# EAGLE design synth r0.1 (EAGLE 9.1.3)
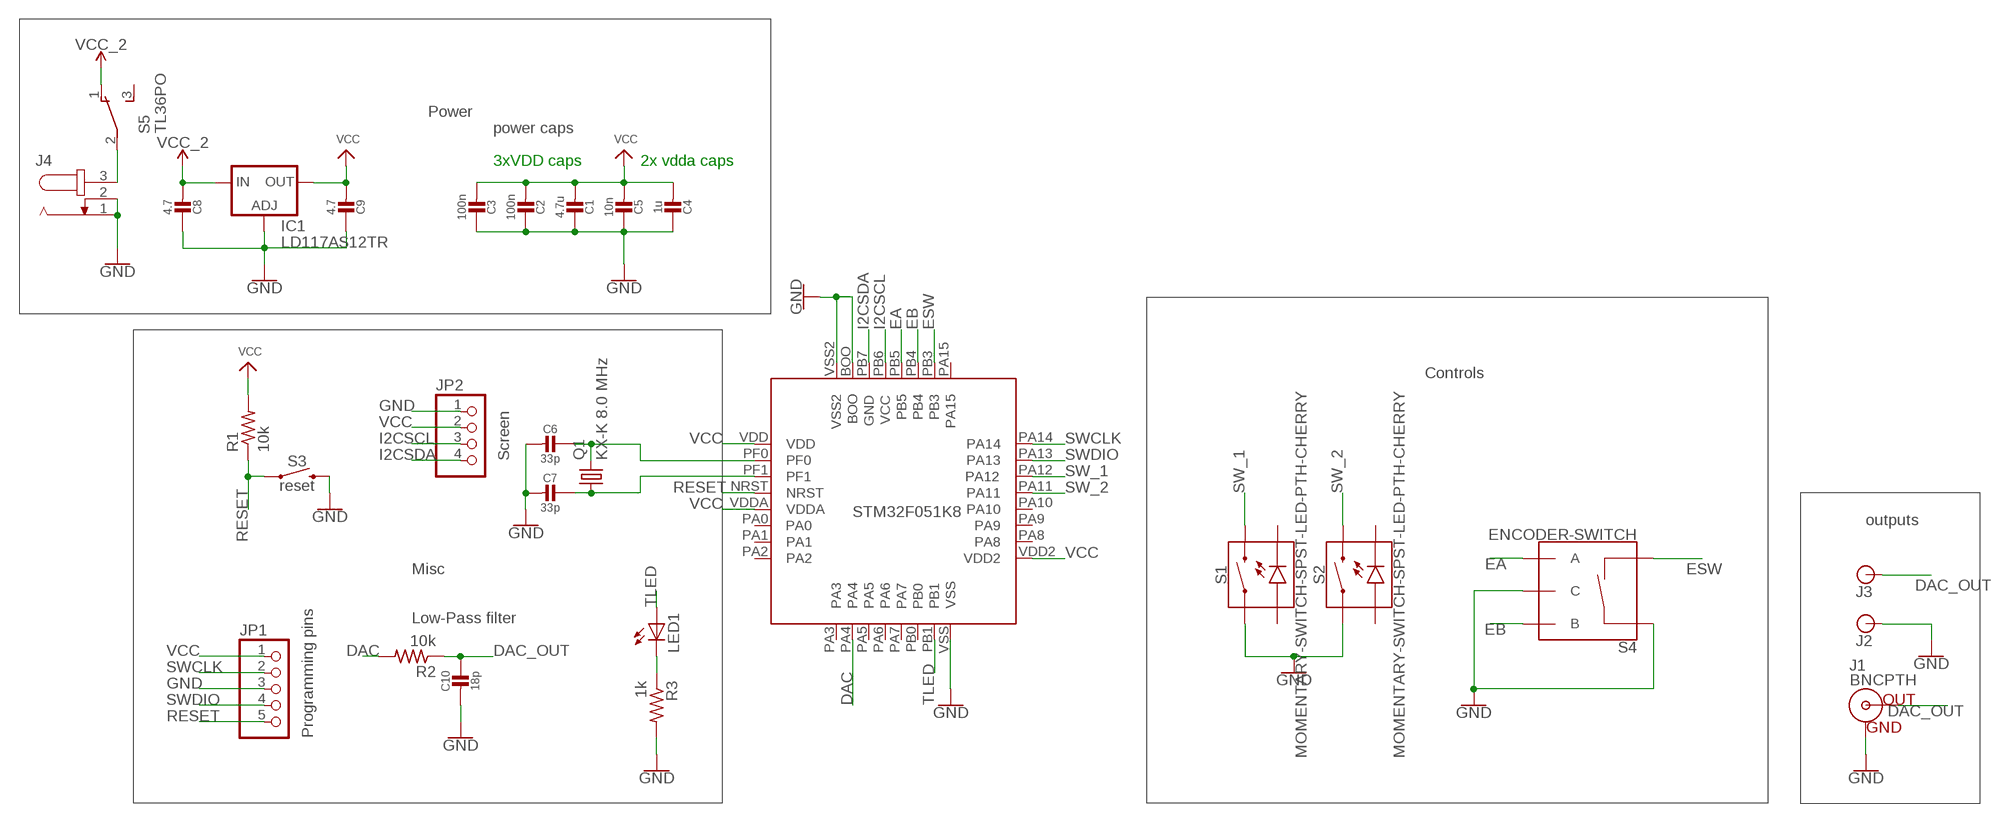
[diagram p0: schematic, sheet 1]

## Parts
C1  4.7u  CAP_CERAMIC0805-NOOUTLINE  [0805-NO]
C2  100n  CAP_CERAMIC0805-NOOUTLINE  [0805-NO]
C3  100n  CAP_CERAMIC0805-NOOUTLINE  [0805-NO]
C4  1u  CAP_CERAMIC0805-NOOUTLINE  [0805-NO]
C5  10n  CAP_CERAMIC0805-NOOUTLINE  [0805-NO]
C6  33p  CAP_CERAMIC0805-NOOUTLINE  [0805-NO]
C7  33p  CAP_CERAMIC0805-NOOUTLINE  [0805-NO]
C8  4.7  CAP_CERAMIC0805-NOOUTLINE  [0805-NO]
C9  4.7  CAP_CERAMIC0805-NOOUTLINE  [0805-NO]
C10  18p  CAP_CERAMIC0805-NOOUTLINE  [0805-NO]
IC1  LD117AS12TR  [SOT223]
J1  BNCPTH  [BNC]
J2  BANANA_CONN  [BANANA_CONN]
J3  BANANA_CONN  [BANANA_CONN]
J4  JACK-PLUG1  [SPC4078]
JP1  PINHD-1X5  [1X05]
JP2  PINHD-1X4  [1X04]
LED1  LEDCHIPLED_0805  [CHIPLED_0805]
Q1  KX-K 8.0 MHz  CRYSTALHC49S  [HC49/S]
R1  10k  R-US_R0805  [R0805]
R2  10k  R-US_R0805  [R0805]
R3  1k  R-US_R0805  [R0805]
S1  MOMENTARY-SWITCH-SPST-LED-PTH-CHERRY  [CHERRY-MX-LED]
S2  MOMENTARY-SWITCH-SPST-LED-PTH-CHERRY  [CHERRY-MX-LED]
S3  reset  MOMENTARY-SWITCH-SPST-SMD-5.2-REDUNDANT  [TACTILE_SWITCH_SMD_5.2MM]
S4  ENCODER-SWITCH  [ROTARY_ENC_PLAIN]
S5  TL36PO  [TL3XPO]
U$1  STM32F051K8  [LQFP32-7X7]

## Nets
DAC: R2.2 U$1.PA4
DAC_OUT: C10.1 J1.S(OUT) J3.P$1 R2.1
EA: S4.A U$1.PB5
EB: S4.B U$1.PB4
ESW: S4.SW- U$1.PB3
GND: C1.1 C2.1 C3.1 C4.1 C5.1 C6.2 C7.2 C8.1 C9.1 C10.2 IC1.1(ADJ) J1.GND J2.P$1 J4.1 J4.2 JP1.3 JP2.1 R3.2 S1.S1 S2.S1 S3.3 S3.4 S4.C S4.SW+ U$1.BOO U$1.VSS U$1.VSS2
I2CSCL: JP2.3 U$1.PB6
I2CSDA: JP2.4 U$1.PB7
N$1: C6.1 Q1.2 U$1.PF0
N$2: C7.1 Q1.1 U$1.PF1
N$8: J4.3 S5.2(P)
N$9: LED1.C R3.1
RESET: JP1.5 R1.1 S3.1 S3.2 U$1.NRST
SW_1: S1.S2 U$1.PA12
SW_2: S2.S2 U$1.PA11
SWCLK: JP1.2 U$1.PA14
SWDIO: JP1.4 U$1.PA13
TLED: LED1.A U$1.PB1
VCC: C1.2 C2.2 C3.2 C4.2 C5.2 C9.2 IC1.4(OUT) JP1.1 JP2.2 R1.2 U$1.VDD U$1.VDD2 U$1.VDDA
VCC_2: C8.2 IC1.3(IN) S5.1(O)
Unconnected: S1.A S1.K(C) S2.A S2.K(C) S5.3(S) U$1.PA1 U$1.PA2 U$1.PA3 U$1.PA5 U$1.PA6 U$1.PA8 U$1.PA9 U$1.PA10 U$1.PA15

## Notes on the sheet
- Power
- power caps
- 3xVDD caps | 2x vdda caps
- Controls
- Screen
- outputs
- Misc
- Low-Pass filter
- Programming pins

## Power pins joined to a net without a drawn wire
PA0: U$1.PA0
PA7: U$1.PA7
PB0: U$1.PB0

## Library data of the parts
C1-C10 = audio amplifier example:CAP_CERAMIC
IC1 = v-reg:LD117A?*: Low drop fixed and adjustable positive voltage regulators 1 A Source: http://www.st.com/stonline/products/literature/ds/7194/ld1117axx.pdf
J1 = SparkFun-Connectors:BNC: BNC Right Angle Connector Mouser Part# 5227161 SparkFun Products: BNC Connector - Right Angle <https://www.sparkfun.com/products/10550>; PROD_ID: LPA-12729; SF_ID: PRT-10550
J2 J3 = SparkFun-Connectors:BANANA_CONN: Through-hole Banana Jack Basic PTH connection for banana jack plugs SparkFun Products: Multimeter Kit <https://www.sparkfun.com/products/retired/10956> Banana to Alligator Cable <https://www.sparkfun.com/products/retired/509> Banana to Alligator Coax Cable <https://www.sparkfun.com/products/retired/508> Banana to Banana Cable <https://www.sparkfun.com/products/retired/507> Banana to IC Hook Cables <https://www.sparkfun.com/products/retired/506>
J4 = con-jack:JACK-PLUG: DC POWER JACK Power Jack, DC, Right Angle, Through Hole, Rated 5A at 16VDC, PC Terminals Distributor: Farnell (www.Farnell.de) Drawing: 84N1161.pdf / 84N1162.pdf Manufacturer: SPC Technology (www.spctechnology.com) Type: SPC4077 / SPC 4078; OC_FARNELL: unknown; OC_NEWARK: unknown
JP1 = pinhead:PINHD-1X5: PIN HEADER
JP2 = pinhead:PINHD-1X4: PIN HEADER
LED1 = led:LED: LED OSRAM: - CHIPLED LG R971, LG N971, LY N971, LG Q971, LY Q971, LO R971, LY R971 LH N974, LH R974 LS Q976, LO Q976, LY Q976 LO Q996 - Hyper CHIPLED LW Q18S LB Q993, LB Q99A, LB R99A - SideLED LS A670, LO A670, LY A670, LG A670, LP A670 LB A673, LV A673, LT A673, LW A673 LH A674 LY A675 LS A676, LA A676, LO A676, LY A676, LW A676 LS A679, LY A679, LG A679 - Hyper Micro SIDELED® LS Y876, LA Y876, LO Y876, LY Y876 LT Y87S - SmartLED LW L88C, LW L88S LB L89C, LB L89S, LG L890 LS L89K, LO L89K, LY L89K LS L896, LA L896, LO L896, LY L896 - TOPLED LS T670, LO T670, LY T670, LG T670, LP T670 LSG T670, LSP T670, LSY T670, LOP T670, LYG T670 LG T671, LOG T671, LSG T671 LB T673, LV T673, LT T673, LW T673 LH T674 LS T676, LA T676, LO T676, LY T676, LB T676, LH T676, LSB T676, LW T676 LB T67C, LV T67C, LT T67C, LS T67K, LO T67K, LY T67K, LW E67C LS E67B, LA E67B, LO E67B, LY E67B, LB E67C, LV E67C, LT E67C LW T67C LS T679, LY T679, LG T679 LS T770, LO T770, LY T770, LG T770, LP T770 LB T773, LV T773, LT T773, LW T773 LH T774 LS E675, LA E675, LY E675, LS T675 LS T776, LA T776, LO T776, LY T776, LB T776 LHGB T686 LT T68C, LB T68C - Hyper Mini TOPLED® LB M676 - Mini TOPLED Santana® LG M470 LS M47K, LO M47K, LY M47K Source: http://www.osram.convergy.de LUXEON: - LUMILED® LXK2-PW12-R00, LXK2-PW12-S00, LXK2-PW14-U00, LXK2-PW14-V00 LXK2-PM12-R00, LXK2-PM12-S00, LXK2-PM14-U00 LXK2-PE12-Q00, LXK2-PE12-R00, LXK2-PE12-S00, LXK2-PE14-T00, LXK2-PE14-U00 LXK2-PB12-K00, LXK2-PB12-L00, LXK2-PB12-M00, LXK2-PB14-N00, LXK2-PB14-P00, LXK2-PB14-Q00 LXK2-PR12-L00, LXK2-PR12-M00, LXK2-PR14-Q00, LXK2-PR14-R00 LXK2-PD12-Q00, LXK2-PD12-R00, LXK2-PD12-S00 LXK2-PH12-R00, LXK2-PH12-S00 LXK2-PL12-P00, LXK2-PL12-Q00, LXK2-PL12-R00 Source: www.luxeon.com KINGBRIGHT: KA-3528ASYC Source: www.kingbright.com
Q1 = crystal:CRYSTAL: CRYSTAL; OC_FARNELL: 1667008; OC_NEWARK: unknown
R1-R3 = audio amplifier example:R-US_: RESISTOR, American symbol
S1 S2 = SparkFun-Switches:MOMENTARY-SWITCH-SPST-LED: Momentary Switch (Pushbutton) - SPST - w/ LED Normally-open (NO) SPST momentary switches (buttons, pushbuttons), with a built-in LED. Variants PTH-CHERRY - Cherry MX Switch Cherry MX Keyswitches are top-of-the-line mechanical keyboard switches. They’re satisfyingly “clicky”, reliable up to tens-of-millions of key presses, and a standard in gaming and programming keyboards across the globe. This ‘blue’ version Cherry MX Switch is favored by most due to its secondary internal actuator making it less likely to “double-tap.” If you are looking for a noticeably audible and high-quality key switch, this is the perfect option for you! Cherry MX Switch <https://www.sparkfun.com/products/13834> (COM-13834) Cherry MX Switch Breakout <https://www.sparkfun.com/products/13773> (BOB-13773) PTH-12MM and PTH-12MM-KIT - 12mm Illuminated LED KIT variant is for soldering kits. There is no tStop (covering up the top side of the pads with mask). This helps the beginner see which side they should be soldering too. LED Tactile Button Breakout <https://www.sparkfun.com/products/10467> (BOB-10467) LED Tactile Button - Red <https://www.sparkfun.com/products/10442> (COM-10442) LED Tactile Button - Blue <https://www.sparkfun.com/products/10443> (COM-10443) LED Tactile Button - Green <https://www.sparkfun.com/products/10440> (COM-10440) LED Tactile Button - Orange <https://www.sparkfun.com/products/10441> (COM-10441) LED Tactile Button - White <https://www.sparkfun.com/products/10439> (COM-10439); SF_ID: COM-13834
S3 = SparkFun-Switches:MOMENTARY-SWITCH-SPST: Momentary Switch (Pushbutton) - SPST Normally-open (NO) SPST momentary switches (buttons, pushbuttons). Variants PTH-12MM - 12mm square, through-hole Momentary Pushbutton Switch - 12mm Square <https://www.sparkfun.com/products/9190> (COM-09190) PTH-6.0MM, PTH-6.0MM-KIT - 6.0mm square, through-hole Mini Pushbutton Switch <https://www.sparkfun.com/products/97> (COM-00097) KIT package intended for soldering kit's - only one side of pads' copper is exposed. PTH-RIGHT-ANGLE-KIT - Right-angle, through-hole Right Angle Tactile Button <https://www.sparkfun.com/products/10791> - Used on SparkFun BigTime Watch Kit <https://www.sparkfun.com/products/11734> SMD-12MM - 12mm square, surface-mount Tactile Button - SMD (12mm) <https://www.sparkfun.com/products/12993> (COM-12993) Used on SparkFun PicoBoard <https://www.sparkfun.com/products/11888> SMD-4.5MM - 4.5mm Square Trackball Switch Used on SparkFun Blackberry Trackballer Breakout <https://www.sparkfun.com/products/13169> SMD-4.6MMX2.8MM - 4.60mm x 2.80mm, surface mount Used on SparkFun SAMD21 Mini Breakout <https://www.sparkfun.com/products/13664> SMD-5.2MM, SMD-5.2-REDUNDANT - 5.2mm square, surface-mount Mini Pushbutton Switch - SMD <https://www.sparkfun.com/products/8720> (COM-08720) Used on Arduino Pro Mini <https://www.sparkfun.com/products/11114> REDUNDANT package connects both switch circuits together SMD-6.0X3.5MM - 6.0 x 3.5mm, surface mount Momentary Reset Switch SMD <https://www.sparkfun.com/products/8229> (COM-08229) SMD-6.2MM-TALL - 6.2mm square, surface mount Tactile Button - SMD (6mm) <https://www.sparkfun.com/products/12992> Used on SparkFun Digital Sandbox <https://www.sparkfun.com/products/12651> SMD-RIGHT-ANGLE - Right-angle, surface mount Used on SparkFun Block for Intel® Edison - Arduino <https://www.sparkfun.com/products/13036>; PROD_ID: SWCH-08247; SF_SKU: COM-08720
S4 = SparkFun-Switches:ENCODER-SWITCH: Rotary Encoder w/ Select Switch Encoders rotate similarly to potentiometers, but they’re different from potentiometers in that an encoder has full rotation without limits. They output gray code so that you can tell how much and in which direction the encoder has been turned. This encoder includes a push-down select switch built into the shaft. SparkFun Products Rotary Encoder <https://www.sparkfun.com/products/9117> (COM-09117); SF_SKU: COM-09117
S5 = switch:TL36PO: TINY SWITCH ON - ON Source: http://www2.produktinfo.conrad.com/datenblaetter/700000-724999/705152-da-01-de-Subminiaturschalter_TL_36YO.pdf
U$1 = STM32F051K8:STM32F051K8

## Board
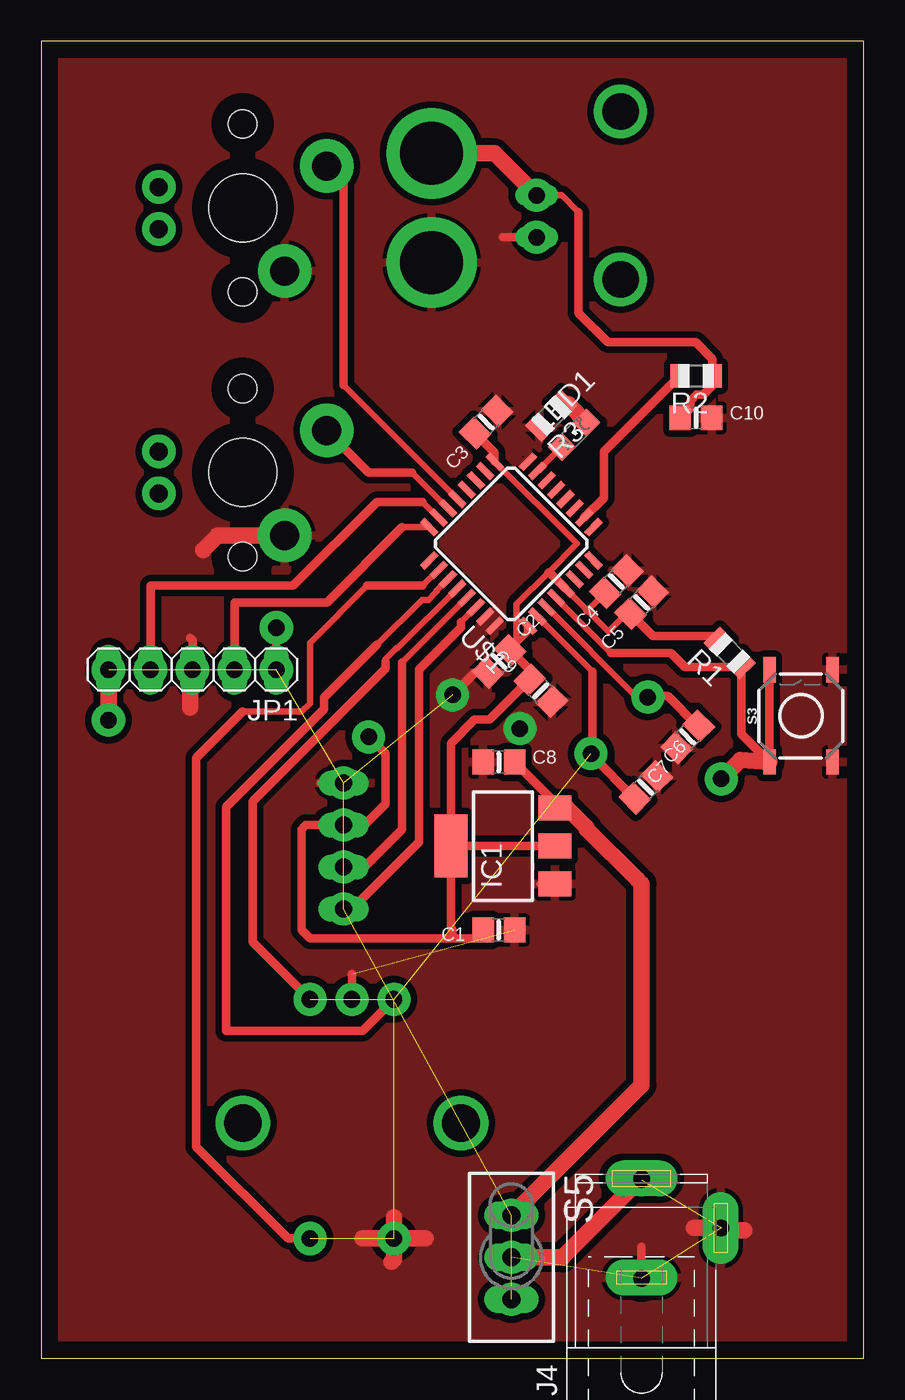
[diagram p1: board, top side]
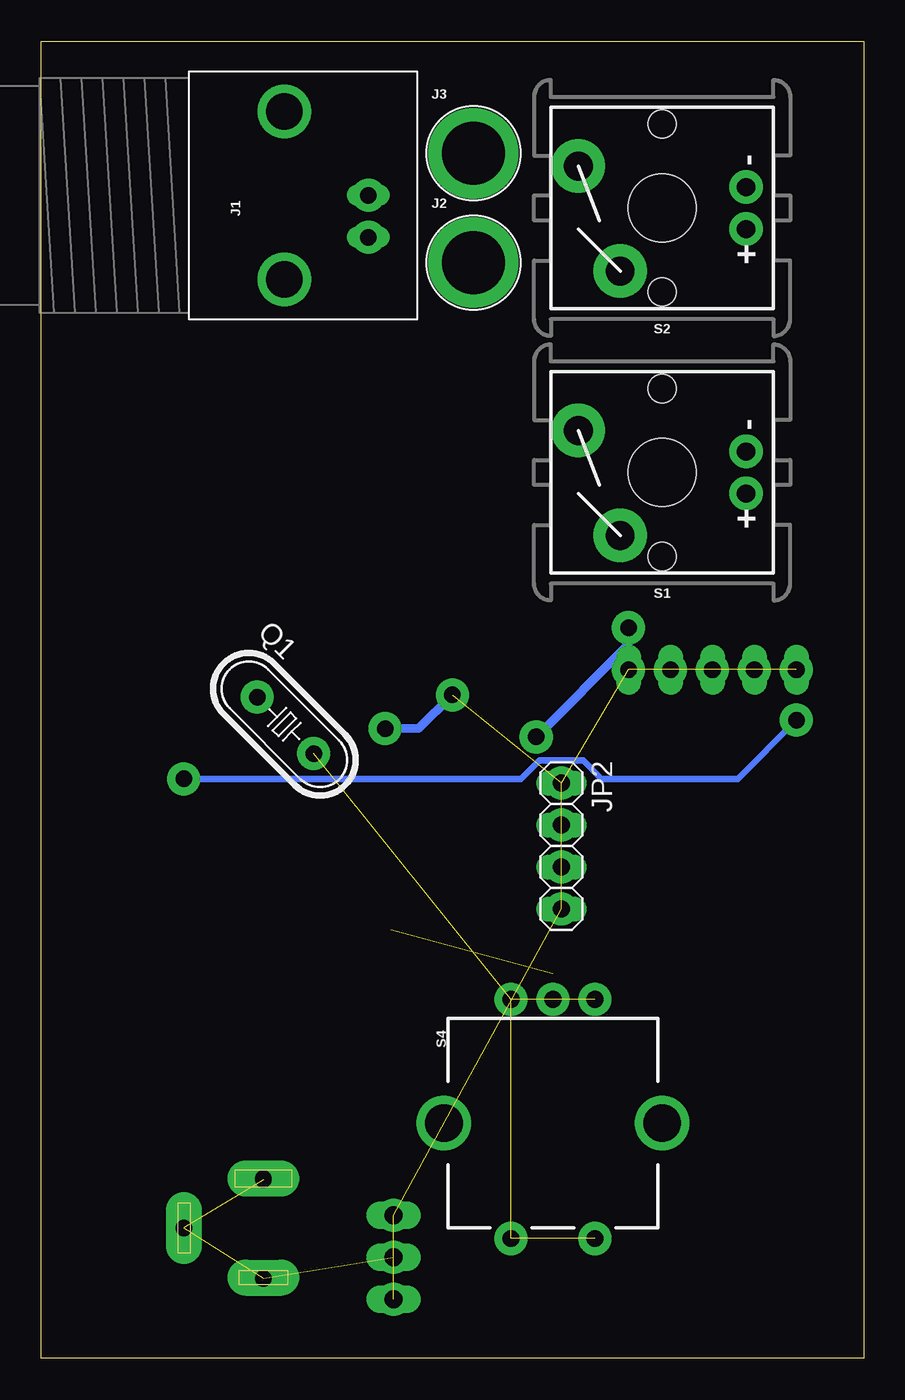
[diagram p2: board, bottom side, seen from below]

Size 49.76 x 79.68 mm. Coordinates in mm from the lower left corner, seen from the top.
Outline: 0,0 49.76,0 49.76,79.68 0,79.68 0,0
Copper layers (1*16): Top 0.035mm / dielectric 1.5mm / Bottom 0.035mm
Design rules "default *": minimum track width 0.4mm, minimum drill 0.35mm, track to track 0.4mm, track to pad 0.4mm, pad to pad 6mil, via to via 6mil, smd to smd 6mil, copper to edge 40mil, drill to drill 6mil, minimum pad ring 10mil, minimum via ring 8mil, stop-mask expansion 4mil, vias tented up to drill 0mil, thermal gap 10mil

### Footprints (pad centres in the part's own frame; a part is rotated, then mirrored left to right if it is on the bottom)
0805-NO = smd 1.3 x 1.5: 1 -0.95,0; 2 0.95,0
SOT223 = smd 1.5 x 2: 1 -2.3,-3.15; 2 0,-3.15; 3 2.3,-3.15 | smd 3.8 x 2: 4 0,3.15
BNC = drill 2.2: 3 -5.08,5.08; 4 5.08,5.08 | drill 0.8 long: GND -2.54,0; S 0,0
BANANA_CONN = drill 3.81 pad 5.461: P$1 0,0
SPC4078 = drill 0.8 pad 2.184 long: 1 -3,0; 2 0,-4.8 | drill 1 pad 2.184 long: 3 3,0
1X05 = drill 1.016 long: 1 -5.08,0; 2 -2.54,0; 3 0,0; 4 2.54,0; 5 5.08,0
1X04 = drill 1.016 long: 1 -3.81,0; 2 -1.27,0; 3 1.27,0; 4 3.81,0
CHIPLED_0805 = smd 1.2 x 1.2: A 0,-1.05; C 0,1.05
HC49/S = drill 0.813: 1 -2.413,0; 2 2.413,0
R0805 = smd 1.1 x 1.4: 1 -1,0; 2 1,0
CHERRY-MX-LED = drill 1.092 pad 2.032: A -1.27,-5.08; K 1.27,-5.08 | drill 1.753 pad 3.226: S1 -3.81,2.54; S2 2.54,5.08 | hole 4.089: 0,0 | hole 1.707: -5.08,0; 5.08,0
TACTILE_SWITCH_SMD_5.2MM = smd 1.524 x 0.762: 1 -2.794,1.905; 2 2.794,1.905; 3 -2.794,-1.905; 4 2.794,-1.905
ROTARY_ENC_PLAIN = drill 1.016: A 7.493,-2.54; B 7.493,2.54; C 7.493,0; SW+ -6.985,2.54; SW- -6.985,-2.54 | drill 2.286: P$3 0,6.604; P$4 0,-6.604
TL3XPO = drill 1.1 pad 1.422 long: 1 -2.54,0; 2 0,0; 3 2.54,0
LQFP32-7X7 = smd 0.4 x 1.2: BOO -2,4.225; PA3 -2.8,-4.225; PA4 -2,-4.225; PA5 -1.2,-4.225; PA6 -0.4,-4.225; PA7 0.4,-4.225; PA15 2.8,4.225; PB0 1.2,-4.225; PB1 2,-4.225; PB3 2,4.225; PB4 1.2,4.225; PB5 0.4,4.225; PB6 -0.4,4.225; PB7 -1.2,4.225; VSS 2.8,-4.225; VSS2 -2.8,4.225 | smd 1.2 x 0.4: NRST -4.225,0.4; PA0 -4.225,-1.2; PA1 -4.225,-2; PA2 -4.225,-2.8; PA8 4.225,-2; PA9 4.225,-1.2; PA10 4.225,-0.4; PA11 4.225,0.4; PA12 4.225,1.2; PA13 4.225,2; PA14 4.225,2.8; PF0 -4.225,2; PF1 -4.225,1.2; VDD -4.225,2.8; VDD2 4.225,-2.8; VDDA -4.225,-0.4

### Placement (x,y rotation side)
C1  27.69,25.91 180 top
C2  27.69,42.16 45 top
C3  26.92,56.64 225 top
C4  34.8,46.99 225 top
C5  36.32,45.72 225 top
C6  36.58,34.54 45 top
C7  39.12,37.59 225 top
C8  27.69,36.07 0 top
C9  30.23,40.39 135 top
C10  39.62,56.9 0 top
IC1  27.94,30.99 90 top
J1  29.97,70.36 90 bottom
J2  23.62,66.29 0 bottom
J3  23.62,72.9 0 bottom
J4  36.32,7.87 90 top
JP1  9.14,41.66 180 top
JP2  18.29,30.99 270 bottom
LED1  32.26,55.88 315 top
Q1  35.05,38.35 315 bottom
R1  41.66,42.67 135 top
R2  39.62,59.44 180 top
R3  30.86,57.02 225 top
S1  12.19,53.59 90 bottom
S2  12.19,69.6 90 bottom
S3  45.97,38.86 90 top
S4  18.8,14.22 90 bottom
S5  28.45,6.1 270 top
U$1  28.45,49.28 135 top

### Tracks (layer width: path | path; a pad name or v marks a point on that pad's centre or on a via)
DAC
  Top 0.5: U$1.PA4 34.04,52.04 34.04,54.85 R2.2
DAC_OUT
  Top 0.4: 32.51,69.34 31.5,70.36 J1.S
  Top 0.5: C10.1 39.27,57.5 39.27,57.91 39.66,58.3 40.07,58.3 40.62,58.85 R2.1 40.62,60.45 39.61,61.47 34.29,61.47 32.51,63.25 32.51,69.34
  Top 1: J1.S 27.43,72.9 J3.P$1
EA
  Top 0.4: U$1.PB5 21.56,42.96 21.49,42.96 20.83,42.29 20.83,42.16
  Top 0.5: 20.83,42.16 20.83,41.72 12.8,33.69 12.8,25.18 S4.A
EB
  Top 0.4: U$1.PB4 23.93,46.45 23.93,46.38 23.43,45.89 23.03,45.89 20.32,43.18
  Top 0.5: 20.32,43.18 17.11,39.97 17.11,39.27 11.18,33.34 11.18,19.81 19.43,19.81 S4.B
ESW
  Top 0.4: U$1.PB3 23.08,46.74 | 19.71,46.74 16.26,43.28 16.26,39.62 15.75,39.12 12.19,39.12
  Top 0.5: 23.08,46.74 19.71,46.74 | S4.SW- 14.92,7.24 9.38,12.78 9.38,36.31 12.19,39.12
GND  (via drill 1 pad 2)  (2 unrouted)
  Top 0.4: IC1.1 30.15,28.69
  Top 0.5: C2.1 26.25,41.49 v24.89,40.13 | S4.C 18.8,23.24 | J1.GND 27.94,67.82 | J4.1 36.32,6.73 | JP2.1 16.89,34.8 | JP1.3 9.14,43.43 9.02,43.56
  Top 1: S4.SW+ 21.34,8.51 | S4.SW+ 21.34,5.97 21.21,5.84 | S4.SW+ 19.43,7.24 | S4.SW+ 23.24,7.24 | 42.55,7.75 41.25,7.75 J4.2 39.5,7.87 | S1.S1 10.67,49.78 9.78,48.89 | JP1.3 9.02,41.53 9.02,39.37
  Bottom 0.5: v24.89,40.13 26.92,38.1 v28.96,38.1
  pour Top: -7.11,79.63 52.32,79.63 52.32,0.51 17.27,0.51 -7.11,0.51
I2CSCL
  Top 0.4: 21.84,42.11 U$1.PB6
  Top 0.5: 21.84,42.11 21.84,32 19.56,29.72 JP2.3
I2CSDA
  Top 0.4: 25.4,44.53 U$1.PB7
  Top 0.5: 25.4,44.53 25.4,44.2 22.86,41.66 22.86,31.24 18.8,27.18 JP2.4
N$1
  Top 0.4: U$1.PF0 33.35,41.55
  Top 0.5: C6.1 33.35,36.43 Q1.2 33.35,41.55
N$2
  Top 0.4: U$1.PF1 35.97,40.06 | 39.71,38.26 C7.1
  Top 0.5: 35.97,40.06 Q1.1 37.92,40.06 39.71,38.26
N$3  (via drill 1 pad 2)  (5 unrouted)
  other vias: 21.34,21.72 18.8,21.72 16.26,21.72 21.34,7.24 16.26,7.24 33.27,36.58
N$4  (via drill 1 pad 2)
  other vias: 36.7,40
N$5  (via drill 1 pad 2)
  other vias: 29.97,70.36
N$6  (via drill 1 pad 2)
  other vias: 29.97,67.82
N$7  (via drill 1 pad 2)  (14 unrouted)
  other vias: 18.29,34.8 18.29,32.26 18.29,29.72 18.29,27.18 14.22,41.66 11.68,41.66 9.14,41.66 6.6,41.66 4.06,41.66 36.32,10.79 41.15,7.87 36.32,4.83 28.45,8.64 28.45,6.1 28.45,3.56
N$8
  Top 1: J4.3 31.54,6.1 S5.2
N$9
  Top 1: LED1.C 31.89,57.73 R3.1
RESET  (via drill 1 pad 2)
  Top 0.4: 42.42,41.81 R1.1 42.26,42.13 | U$1.NRST 34.49,42.67
  Top 0.5: 34.49,42.67 38.1,42.67 38.96,41.81 42.42,41.81 | S3.2 S3.1 42.36,37.77 R1.1
  Top 1: v41.15,35.05 42.29,36.2 S3.1 | v4.06,38.61 JP1.5
  Bottom 0.4: v4.06,38.61 7.62,35.05 15.85,35.05 16.96,36.16 19.61,36.16 20.72,35.05 v41.15,35.05
SW_1
  Top 0.4: U$1.PA12 22.52,53.51 | 22.52,53.51 22.43,53.59 | 22.52,53.51
  Top 0.5: 22.43,53.59 19.81,53.59 S1.S2
SW_2
  Top 0.4: 18.29,58.87 U$1.PA11
  Top 0.5: 18.29,58.87 18.29,71.12 S2.S2
SWCLK
  Top 0.4: 21.84,50.28 U$1.PA14
  Top 0.5: JP1.2 11.68,45.72 17.28,45.72 21.84,50.28
SWDIO
  Top 0.4: U$1.PA13 23.08,51.82
  Top 0.5: 23.08,51.82 20.32,51.82 15.24,46.74 6.6,46.74 JP1.4
TLED
  Top 0.4: U$1.PB1 31.48,55.14 LED1.A
VCC  (via drill 1 pad 2)
  Top 0.4: 28.84,43.32 C2.2 28.38,42.85 | 28.84,43.32 29.4,43.88 29.4,44.2 U$1.VDD | U$1.VDD2 27.49,54.2 32.42,49.28 30.69,47.55 28.77,45.62 28.77,43.4 28.84,43.32 | U$1.VDDA 33.05,45.24 | 33.05,45.24 34.32,43.97 35.4,45.05 | C4.2 33.05,45.24 | C1.2 26.74,25.72
  Top 0.5: U$1.VDDA 30.74,47.55 30.69,47.55 | IC1.4 24.79,26.01 24.89,25.91 24.89,25.4 | 35.4,45.05 C5.2 37.01,43.69 40.64,43.69 R1.2 | C3.2 27.44,54.78 U$1.VDD2 | 24.89,25.4 16.26,25.4 15.75,25.91 15.75,32 16,32.26 JP2.2 19.56,32.26 20.83,33.53 20.83,36.58 v19.81,37.59 | 24.89,25.4 26.42,25.4 26.74,25.72 | v14.22,44.2 JP1.1 | IC1.4 24.79,37.2 26.23,38.64 27.14,38.64 C9.2 29.55,41.68 28.38,42.85 | IC1.4 30.99,30.99 | 33.05,45.24
  Bottom 0.5: v14.22,44.2 14.22,43.18 v19.81,37.59
VCC_2
  Top 0.5: C8.2 31.09,33.61 IC1.3 31.37,33.29 | 36.32,28.7 36.07,28.96
  Top 1: S5.1 36.32,16.51 36.32,28.7 | 36.07,28.96 32.99,32.03 32.99,32.11 31.81,33.29 31.37,33.29